# Altium schematic sheet Pin Connections.SchDoc
size A; SheetNumber: 3; SheetTotal: 3
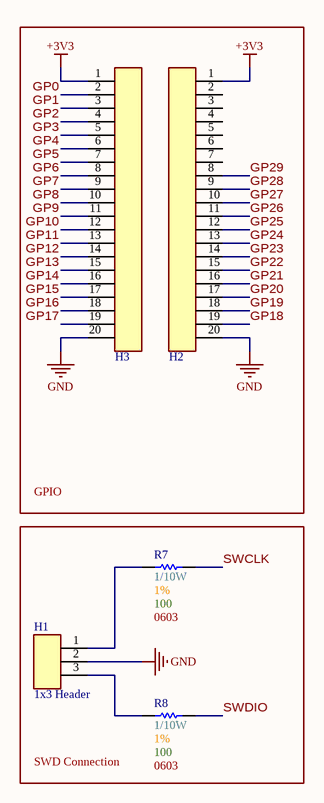
[diagram p0: Pin Connections.SchDoc]

## Parts
H1  1x3 Header  [[Header] 1x3 Male]
H2  1x20 Header  [[Header] 1x20 Male]  (value not drawn)
H3  1x20 Header  [[Header] 1x20 Male]  (value not drawn)
R7  Wattage: 1/10W  Tolerance: 1%  Resistance: 100  Size Package: 0603  [[Res] SMD 0603]  (hidden comment: [100] SMD 0603 1% 1/10W)
R8  Wattage: 1/10W  Tolerance: 1%  Resistance: 100  Size Package: 0603  [[Res] SMD 0603]  (hidden comment: [100] SMD 0603 1% 1/10W)

## Blocks framed on the sheet
GPIO: H2 H3
SWD Connection: H1 R7 R8

## Nets
+3V3: H2.1 H3.1
GND: H1.2 H2.20 H3.20
GP0: H3.2
GP1: H3.3
GP2: H3.4
GP3: H3.5
GP4: H3.6
GP5: H3.7
GP6: H3.8
GP7: H3.9
GP8: H3.10
GP9: H3.11
GP10: H3.12
GP11: H3.13
GP12: H3.14
GP13: H3.15
GP14: H3.16
GP15: H3.17
GP16: H3.18
GP17: H3.19
GP18: H2.19
GP19: H2.18
GP20: H2.17
GP21: H2.16
GP22: H2.15
GP23: H2.14
GP24: H2.13
GP25: H2.12
GP26: H2.11
GP27: H2.10
GP28: H2.9
GP29: H2.8
SWCLK: R7.2
SWDIO: R8.2
NetH1_1: H1.1 R7.1
NetH1_3: H1.3 R8.1

Not connected (* = marked no-connect by the designer): H2 2 3 4 5 6 7

## Library data of the parts
H1 = [Header] 1x3 Male: 2.54mm pitch
H2 H3 = [Header] 1x20 Male: 2.54mm pitch
R7 R8 = [100] SMD 0603 1% 1/10W: RC0603FR-07100RL; Supplier 1: DigiKey; Supplier Part Number 1: 311-100HRDKR-ND